# Altium schematic sheet RK3566_SDMMC.SchDoc
size A3; SheetNumber: 4; SheetTotal: 8
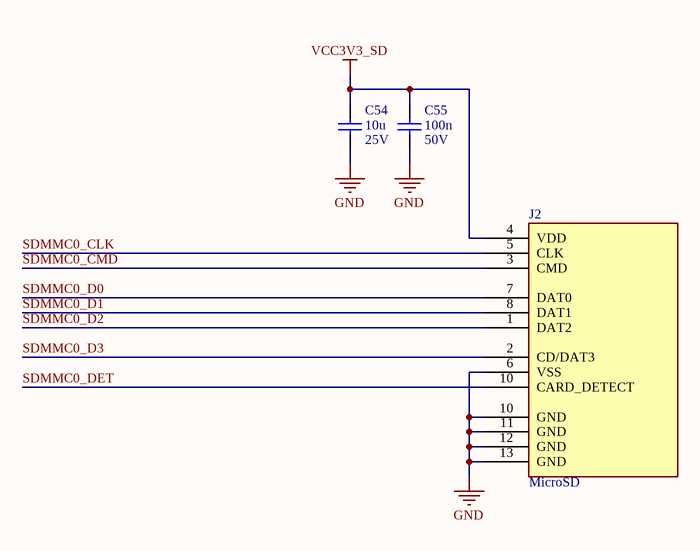
[diagram p0: RK3566_SDMMC.SchDoc]

## Parts
C54  value 10u  Voltage: 25V  (hidden comment: GRM188R61E106MA73D)
C55  value 100n  Voltage: 50V  (hidden comment: GRM155R71H104KE14D)
J2  MicroSD

## Nets
GND: C54.2 C55.2 J2.6(VSS) J2.10(GND) J2.11(GND) J2.12(GND) J2.13(GND)
VCC3V3_SD: C54.1 C55.1 J2.4(VDD)
SDMMC0_CLK: J2.5(CLK)
SDMMC0_CMD: J2.3(CMD)
SDMMC0_D0: J2.7(DAT0)
SDMMC0_D1: J2.8(DAT1)
SDMMC0_D2: J2.1(DAT2)
SDMMC0_D3: J2.2(CD/DAT3)
SDMMC0_DET: J2.10(CARD_DETECT)

## Library data of the parts
C54 = GRM188R61E106MA73D: CAP 10U 25V X5R 0603; Size: 0603; Dielectric: X5R
C55 = GRM155R71H104KE14D: CAP 100N 50V X7R 0402; Size: 0402; Dielectric: X7R